# Altium project gprs.PrjPcb
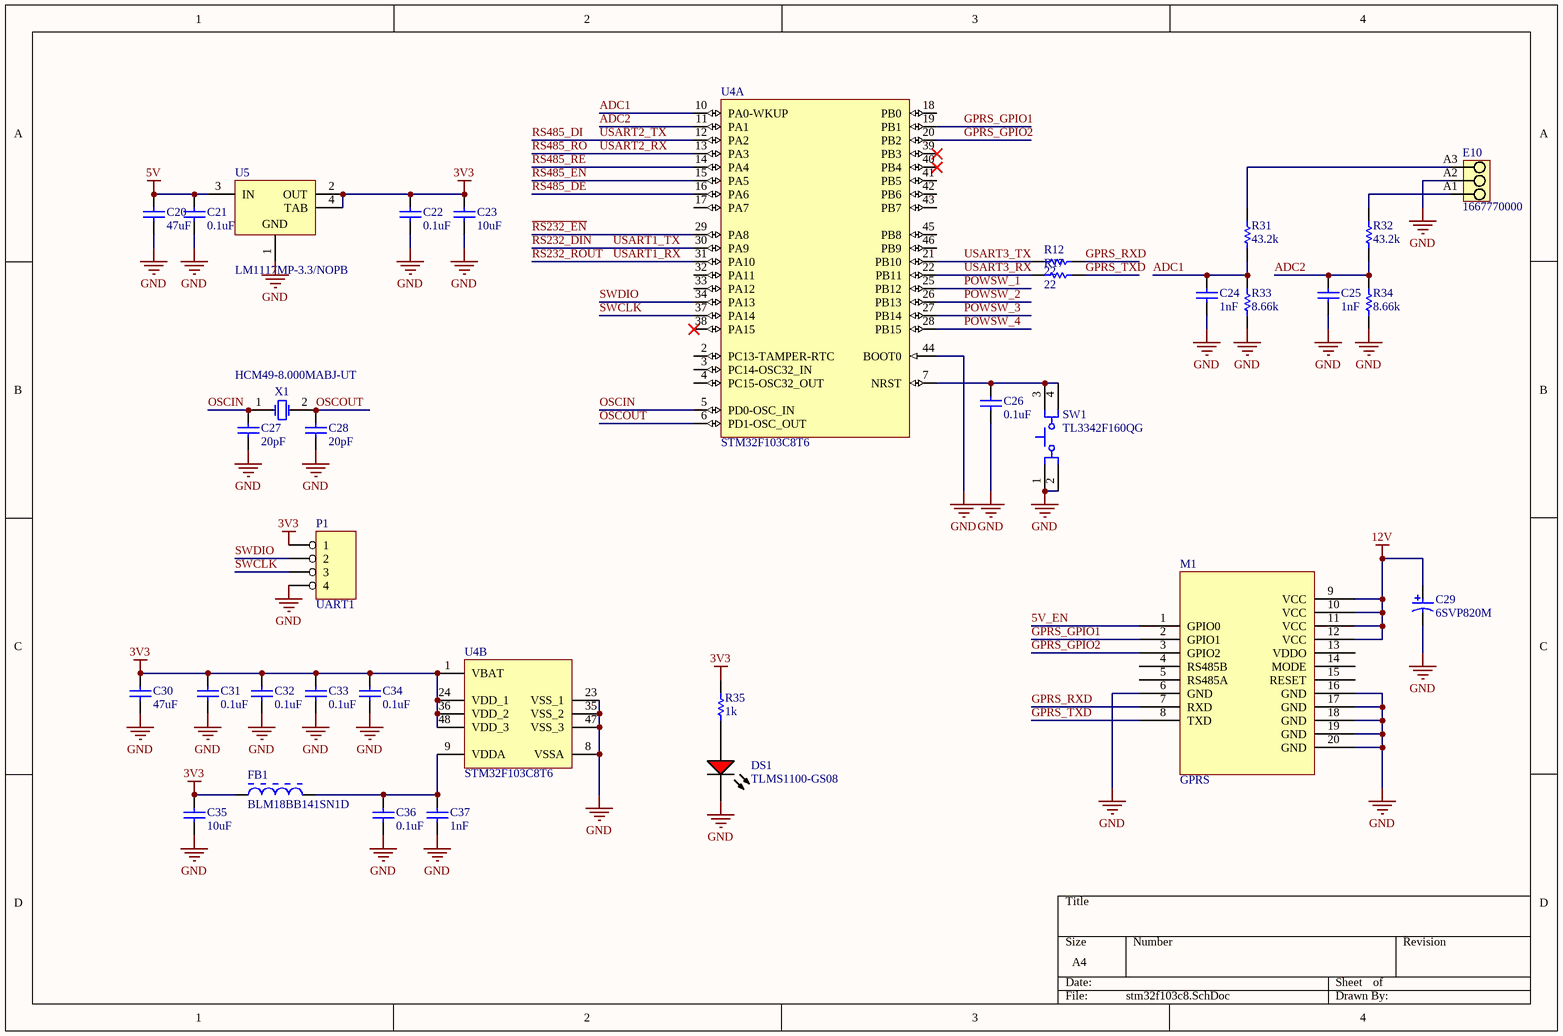
[diagram p0: stm32f103c8.SchDoc]
3 sheets, 114 parts. Net scope: global (net labels, ports and power ports of the same name join across sheets).
Board file: gprs1.PcbDoc
Sheets:
  stm32f103c8.SchDoc
  485&232.SchDoc
  power.SchDoc

## Sheet stm32f103c8.SchDoc
size A4

### Parts
C20  47uF  [CAPC1206(3216)150_L]
C21  0.1uF  [CAPC0603(1608)100_L]
C22  0.1uF  [CAPC0603(1608)100_L]
C23  10uF  [CAPC0805(2012)145_L]
C24  1nF  [CAPC0603(1608)100_L]
C25  1nF  [CAPC0603(1608)100_L]
C26  0.1uF  [CAPC0603(1608)100_L]
C27  20pF  [CAPC0603(1608)100_L]
C28  20pF  [CAPC0603(1608)100_L]
C29  6SVP820M  [PNSC-SVP-F12_L]
C30  47uF  [CAPC1206(3216)150_L]
C31  0.1uF  [CAPC0603(1608)100_L]
C32  0.1uF  [CAPC0603(1608)100_L]
C33  0.1uF  [CAPC0603(1608)100_L]
C34  0.1uF  [CAPC0603(1608)100_L]
C35  10uF  [CAPC0603(1608)100_L]
C36  0.1uF  [CAPC0603(1608)100_L]
C37  1nF  [CAPC0603(1608)100_L]
DS1  TLMS1100-GS08  [VISH-TLMX1100_V]
E10  1667770000  [LM_3_5_90_03]
FB1  BLM18BB141SN1D  [MURA-BLM18-RF-H4-CHIP-2_V]
M1  GPRS  [GPRS]
P1  UART1  [header4]
R12  22  [RESC0603(1608)_L]
R17  22  [RESC0603(1608)_L]
R31  43.2k  [RESC0603(1608)_L]
R32  43.2k  [RESC0603(1608)_L]
R33  8.66k  [RESC0603(1608)_L]
R34  8.66k  [RESC0603(1608)_L]
R35  1k  [RESC0603(1608)_L]
SW1  TL3342F160QG  [ESWI-TL3342F160QG_V]
U4  STM32F103C8T6  [STM-LQFP48_L]  (parts A,B of 2)
U5  LM1117MP-3.3/NOPB  [DCY0004A_L]
X1  HCM49-8.000MABJ-UT  [CFM-HCM49-2_V]

### Nets
3V3: C22.2 C23.2 C30.2 C31.2 C32.2 C33.2 C34.2 C35.2 FB1.1 P1.1 R35.2 U4.1(VBAT) U4.24(VDD_1) U4.36(VDD_2) U4.48(VDD_3) U5.2(OUT) U5.4(TAB)
5V: C20.2 C21.2 U5.3(IN)
12V: C29.1 M1.9(VCC) M1.10(VCC) M1.11(VCC) M1.12(VCC)
GND: C20.1 C21.1 C22.1 C23.1 C24.1 C25.1 C26.1 C27.1 C28.1 C29.2 C30.1 C31.1 C32.1 C33.1 C34.1 C35.1 C36.1 C37.1 DS1.2(K) E10.A2 M1.6(GND) M1.16(GND) M1.17(GND) M1.18(GND) M1.19(GND) M1.20(GND) P1.4 R33.1 R34.1 SW1.1 SW1.2 U4.8(VSSA) U4.23(VSS_1) U4.35(VSS_2) U4.44(BOOT0) U4.47(VSS_3) U5.1(GND)
5V_EN: M1.1(GPIO0)
ADC1: C24.2 R31.1 R33.2 U4.10(PA0-WKUP)
ADC2: C25.2 R32.1 R34.2 U4.11(PA1)
GPRS_GPIO1: M1.2(GPIO1) U4.19(PB1)
GPRS_GPIO2: M1.3(GPIO2) U4.20(PB2)
GPRS_RXD: M1.7(RXD) R12.1
GPRS_TXD: M1.8(TXD) R17.1
OSCIN: C27.2 U4.5(PD0-OSC_IN) X1.1(X1)
OSCOUT: C28.2 U4.6(PD1-OSC_OUT) X1.2(X2)
POWSW_1: U4.25(PB12)
POWSW_2: U4.26(PB13)
POWSW_3: U4.27(PB14)
POWSW_4: U4.28(PB15)
~{RS232_EN}: U4.29(PA8)
~{RS485_EN}: U4.15(PA5)
RS232_DIN: U4.30(PA9)  [also labelled USART1_TX]
RS232_ROUT: U4.31(PA10)  [also labelled USART1_RX]
RS485_DE: U4.16(PA6)
RS485_DI: U4.12(PA2)  [also labelled USART2_TX]
RS485_~{RE}: U4.14(PA4)
RS485_RO: U4.13(PA3)  [also labelled USART2_RX]
SWCLK: P1.3 U4.37(PA14)
SWDIO: P1.2 U4.34(PA13)
USART3_RX: R17.2 U4.22(PB11)
USART3_TX: R12.2 U4.21(PB10)
NetC26_2: C26.2 SW1.3 SW1.4 U4.7(NRST)
NetC36_2: C36.2 C37.2 FB1.2 U4.9(VDDA)
NetDS1_1: DS1.1(A) R35.1
NetE10_A1: E10.A1 R32.2
NetE10_A3: E10.A3 R31.2

Not connected (* = marked no-connect by the designer): M1 4(RS485B) 5(RS485A) 13(VDDO) 14(MODE) 15(RESET); U4 2(PC13-TAMPER-RTC) 3(PC14-OSC32_IN) 4(PC15-OSC32_OUT) 17(PA7) 18(PB0) 32(PA11) 33(PA12) 38(PA15)* 39(PB3)* 40(PB4)* 41(PB5) 42(PB6) 43(PB7) 45(PB8) 46(PB9)

### Library data of the parts
C20 C30 = CAP_5_3: 1206 (3216 Metric) Chip Capacitor; Case-Metric: 3216; Case-EIA: 1206; PackageReference: CAPC1206(3216)150
C21 C22 C24-C28 C31-C37 = CAP_5: 0603 (1608 Metric) Chip Capacitor; Case-Metric: 1608; Case-EIA: 0603; PackageReference: CAPC0603(1608)100
C23 = CAP_5_1: 0805 (2012 Metric) Chip Capacitor; Case-EIA: 0805; Case-Metric: 2012; PackageReference: CAPC0805(2012)145
C29 = CMP-2000-05494-1: Conductive Polymer Aluminum Solid Capacitor, 820 uF, +/- 20%, 6.3 V, -55 to 105 degC, 2-Pin SMD (F12), RoHS, Tape and Reel; Manufacturer: Panasonic; Featured Product: OS-CONCapacitorsHotNewTechnologies; Surface Mount Land Size: 0.406"Lx0.406"W(10.30mmx10.30mm); Online Catalog: OS-CON,SVPSeries; Other Names: P16463TR; ESR (Equivalent Series Resistance): 16mOhm; Lifetime @ Temp.: 2000Hrs@105°C; Polarization: Polar; Voltage Rating: 16V; Ripple Current: 4.72A; EDA / CAD Models: DownloadfromAcceleratedDesigns; Capacitance: 330µF; Operating Temperature: -55°C~105°C; Family: Aluminum-PolymerCapacitors; Packaging: Tape&Reel(TR); Series: OS-CON,SVP; Package Reference: SVP-F12; Package / Case: Radial,Can-SMD; Size / Dimension: 0.394"Dia(10.00mm); Mounting Type: SurfaceMount; Package Description: 2-Pin Surface Mount Device, Body 10.3 x 10.3 mm; Category: Capacitors; Datasheet URL: https://industrial.panasonic.com/cdbs/www-data/pdf/AAB8000/AAB8000C193.pdf; Tolerance: ±20%; Manufacturer URL: http://www.panasonic.com/; Height - Seated (Max): 0.500"(12.70mm); Mounting Technology: SurfaceMount; Datasheet Version: 11/2015; Standard Package: 400
DS1 = CMP-1666-00027-1: LED, RED, 2.1 V, -40 to 100 degC, 2-Pin SMD (0603), RoHS, Tape and Reel; Type (Capacitors): C0G; Resistance: 100000000000 Ohm; Capacitance: 12 pF; Voltage Rating: 50 V; Tolerance: 5%; Min Operating Temperature: -55degC; REACH SVHC: No SVHC; ComponentLink2Description: Datasheet; ComponentLink1URL: http://www.vishay.com/; Width: 0.8 mm; Package Quantity: 4000; PackageReference: TLMX1100; ComponentLink2URL: http://www.vishay.com/docs/83173/tlmb1100.pdf; Case/Package: 0603; Case Code (Metric): 1608; Packaging: Tape and Reel; Pins: 2; ComponentLink1Description: Manufacturer URL; Max Operating Temperature: 125degC; Height: 0.8 mm; Length: 1.6 mm; Mount: Surface Mount; PackageDescription: 2-Pin Surface Mount Device, Body 1.6 x 0.8 mm; DatasheetVersion: Rev. 2.7, 03/2016; Case Code (Imperial): 0603; Voltage Rating (DC): 50 V; RoHSCompliant: True; Radiation Hardening: No
E10 = CMP-1559-01729-1: OMNIMATE Signal - series LM; Manufacturer: Weidmueller; Contact_material: Cu-Leg; Contact_surface: tinned; Rated_current_use_group_B_UL_1059: 10 A; Insulating_material: PA; Wire_cross_section_AWG_min_UL_1059: AWG 28; Short_text_for_material: LM 3.50/03/90 3.2SN OR BX; Solid_max_H05_07_V_U: 1,5 mm²; Rated_current_min_no_of_poles_TU_20_deg_C: 32 A; Solder_pin_length_mm: 3,2 mm; Mounting_onto_the_PCB: Solder connection; Wire_cross_section_AWG_max_UL_1059: AWG 14; No_of_poles: 3; Rated_voltage_use_group_B_UL_1059: 300 V; Side_termination_characteristic: closed side; Rated_voltage_for_surge_voltage_class_pollution_degree_II_2: 320 V; UL_94_flammability_rating: V-2; Pitch_mm: 3,5 mm; Pitch_inch: 0,138 inch; Solid_min_H05_07_V_U: 0,5 mm²; ComponentLink2URL: http://catalog.weidmueller.com/catalog/Start.do?localeId=en&ObjectID=1667770000; Revision: V1; ComponentLink2Description: URL Link1; Packaging: Box; Colour: Orange; ComponentLink1Description: Manufacturer URL; PackageReference: LM_3_5_90_03; Qty: 100 PCS; PartNumber: 1667770000; ComponentLink1URL: http://www.weidmueller.com/
FB1 = MURA-FB-2: Chip Ferrite Bead for High-speed Signal Lines, 140 Ohm, 450 mA, -55 to 125 degC, 1.6 x 0.8 x 0.95 mm SMD, Tape and Reel; Manufacturer: Murata; Rated Current: 450 mA; DC Resistance: 0.35 Ohm Max.; Impedance (at 100 MHz): 140 Ohm +/- 25%; ComponentLink2URL: http://www.murata.com/products/catalog/pdf/c31e.pdf; ComponentLink1Description: Manufacturer URL; ComponentLink1URL: http://www.murata.com/; Packing: Tape and Reel; ComponentLink3URL: http://www.murata.com/products/catalog/pdf/c31e.pdf; PartNumber: BLM18BB141SN1D; Operating Temperature Range: -55 to 125 degC; PackageReference: BLM18_H950-2; DatasheetVersion: 08/2013; ComponentLink3Description: Package Specification; ComponentLink2Description: Datasheet; PackageDescription: 2-Pin Chip, Body 1.6 x 0.8 mm; Mounting Technology: Surface Mount
M1 = GPRS_M
P1 = HEADER 4
R12 R17 R31-R35 = RES_3_1: 0603 (1608 Metric) Chip Resistor; Case-Metric: 1608; Case-EIA: 0603; PackageReference: RESC0603(1608)
SW1 = CMP-1696-00003-1: Switch, Tactile, SPST-NO, 50 mA, 12 V, 4-Pin SMD, RoHS, Tape and Reel; Voltage Rating (DC): 50 V; Tolerance: 20%; Case\Package: Radial; Capacitance: 4.7 uF; Max Operating Temperature: 85 degC; REACH SVHC: No SVHC; Package Quantity: 200; Voltage Rating: 50 V; ComponentLink1Description: Manufacturer URL; ComponentLink2URL: http://spec_sheets.e-switch.com/specs/P010632.pdf; ComponentLink2Description: Datasheet; Height: 11 mm; Lead Pitch: 2 mm; RoHSCompliant: true; Radiation Hardening: No; Pins: 2; Length: 11 mm; DatasheetVersion: Rev. I, 12/2010; PackageReference: TL3342F160QG; ComponentLink1URL: http://www.e-switch.ch/en/; PackageDescription: 4-Pin Surface Mount Device, Body 5 x 5 mm, Pitch 6.3 mm; Mount: Through Hole; Diameter: 5 mm; Packaging: Bulk; Min Operating Temperature: -40 degC; Width: 0 inch
U4 = CMP-0237-00215-3: ARM Cortex-M3 32-bit MCU, 64 KB Flash, 20 KB Internal RAM, 37 I/Os, 48-pin LQFP, -40 to 85 degC, Tray; Supply Voltage(Vcc) min (V): 2; Internal RAM Size (kB): 20; FLASH Size (Prog) (kB): 64; A/D Converter: 2x12-bit (10 Channel); I/Os (High Current): 37; Operating Frequency(F) (Processor speed) (MHz): 72; Core: ARM Cortex-M3; ComponentLink3Description: Package Specification; Mounting Technology: Surface Mount; PartNumber: STM32F103C8T6; PackageReference: LQFP48; Packing: Tray; ComponentLink3URL: http://www.st.com/st-web-ui/static/active/en/resource/technical/document/datasheet/DM00058181.pdf; DatasheetVersion: Rev. 16; ComponentLink1URL: http://www.st.com/web/en/home.html; PackageVersion: Rev. 6, 06/2013; ComponentLink2URL: http://www.st.com/st-web-ui/static/active/en/resource/technical/document/datasheet/CD00161566.pdf; ComponentLink1Description: Manufacturer URL; ComponentLink2Description: Datasheet; PackageDescription: 48-Pin Low Profile Quad Flat Package, 7 x 7 mm Body, 0.5 mm Pitch
U5 = CMP-0062-01638-4: 800mA Low-Dropout Linear Regulator, 4-pin SOT-223, Pb-Free; Manufacturer: Texas Instruments; CompType: LDO IC; PackageTopMarking: XYTT*N05A; High-Reliability: Y; PowerWise: N; ComponentLink1URL: http://www.ti.com/general/docs/lit/getliterature.tsp?genericPartNumber=LM1117-N&fileType=pdf; PinCount: 4; PackageDescription: Molded SOT-223, 6.50 x 3.56 x 1.6mm Body, 4 Lead, 2.3mm Pitch; Code_IPC: SOT223-4; PartNumber: LM1117MP-3.3/NOPB; Code_JEDEC: TO-261-AA; RoHS: Y; PackageReference: DCY0004A; ComponentLink1Description: Datasheet URL
X1 = CMP-1215-00001-1: At-Cut Crystal Unit, 3.5 to 30 MHz, -40 to 85 degC, 2-Pin 11.4Ã—4.7Ã—4.3 mm SMD, RoHS, Reel; Manufacturer: Citizen Finetech Miyota; DL: 100 uW; C0: 7 pF Max.; R1: 50 to 200 Ohm; IR: 500 MOhm Min.; f0: 3.5 to 30 MHz; Mounting Technology: Surface Mount; Packing: Reel; ComponentLink2URL: http://cfm.citizen.co.jp/english/product/pdf/HCM49.pdf; PartNumber: HCM49-8.000MABJ-UT; Operating Temperature: -40 to 85 degC; ComponentLink3URL: http://cfm.citizen.co.jp/english/product/pdf/HCM49.pdf; ComponentLink2Description: Datasheet; ComponentLink3Description: Package Specification; ComponentLink1Description: Manufacturer URL; PackageDescription: 2-Pin Surface Mount, Body 11.4 x 4.7 mm, Pitch 8.5 mm; DatasheetVersion: Jan-12; RoHS: TRUE; ComponentLink1URL: http://cfm.citizen.co.jp/english/index.html

## Sheet 485&232.SchDoc
size A4
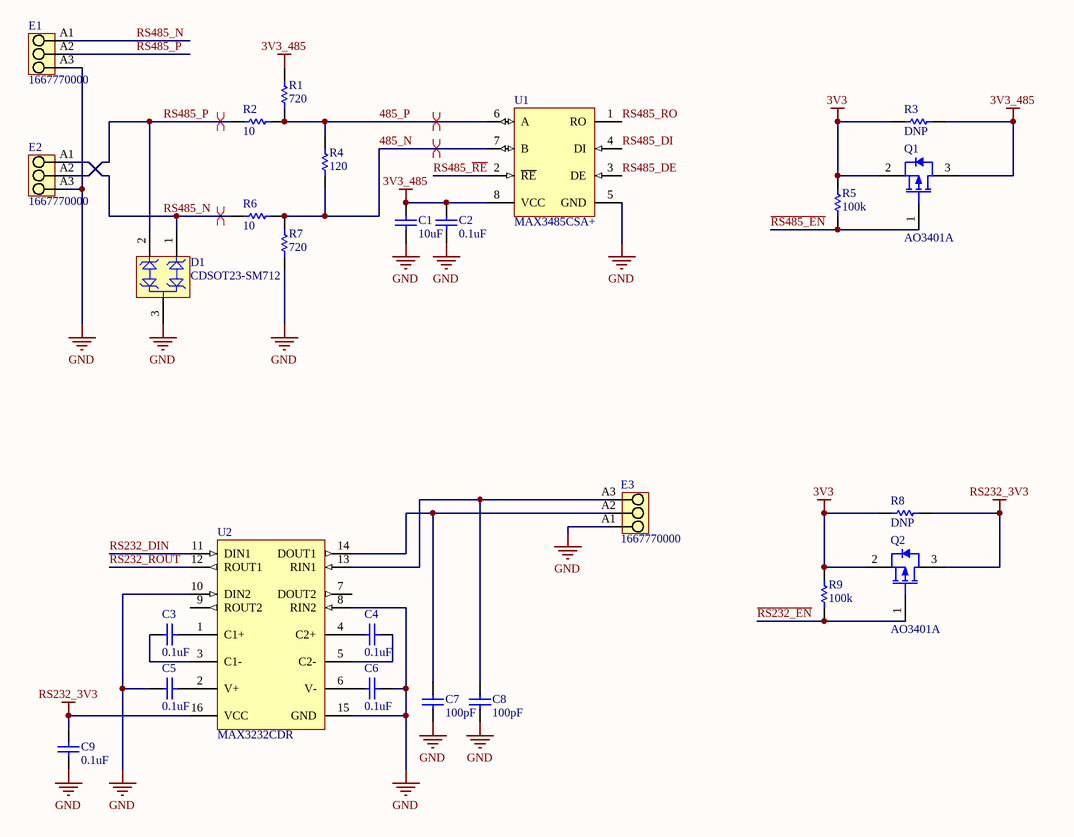
[diagram p1: 485&232.SchDoc]

### Parts
C1  10uF  [CAPC0805(2012)145_L]
C2  0.1uF  [CAPC0603(1608)100_L]
C3  0.1uF  [CAPC0603(1608)100_L]
C4  0.1uF  [CAPC0603(1608)100_L]
C5  0.1uF  [CAPC0603(1608)100_L]
C6  0.1uF  [CAPC0603(1608)100_L]
C7  100pF  [CAPC0603(1608)100_L]
C8  100pF  [CAPC0603(1608)100_L]
C9  0.1uF  [CAPC0603(1608)100_L]
D1  CDSOT23-SM712  [BOUR-SOT23-3_V]
E1  1667770000  [LM_3_5_90_03]
E2  1667770000  [LM_3_5_90_03]
E3  1667770000  [LM_3_5_90_03]
Q1  AO3401A  [AO-SOT-23-3L_V]
Q2  AO3401A  [AO-SOT-23-3L_V]
R1  720  [RESC0603(1608)_L]
R2  10  [RESC0603(1608)_L]
R3  DNP  [RESC0603(1608)_L]
R4  120  [RESC0603(1608)_L]
R5  100k  [RESC0603(1608)_L]
R6  10  [RESC0603(1608)_L]
R7  720  [RESC0603(1608)_L]
R8  DNP  [RESC0603(1608)_L]
R9  100k  [RESC0603(1608)_L]
U1  MAX3485CSA+  [SOIC-8]
U2  MAX3232CDR  [D0016A_L]

### Nets
3V3: Q1.2(SOURCE) Q2.2(SOURCE) R3.1 R5.1 R8.1 R9.1
3V3_485: C1.2 C2.2 Q1.3(DRAIN) R1.1 R3.2 U1.8(VCC)
GND: C1.1 C2.1 C5.2 C6.2 C7.1 C8.1 C9.1 D1.3 E1.A3 E2.A3 E3.A1 R7.2 U1.5(GND) U2.8(RIN2) U2.10(DIN2) U2.15(GND)
RS232_3V3: C9.2 Q2.3(DRAIN) R8.2 U2.16(VCC)
485_N: R4.2 R6.2 R7.1 U1.7(B)
485_P: R1.2 R2.2 R4.1 U1.6(A)
~{RS232_EN}: Q2.1(GATE) R9.2
~{RS485_EN}: Q1.1(GATE) R5.2
RS232_DIN: U2.11(DIN1)
RS232_ROUT: U2.12(ROUT1)
RS485_DE: U1.3(DE)
RS485_DI: U1.4(DI)
RS485_N: D1.1 E1.A1 E2.A1 R6.1
RS485_P: D1.2 E1.A2 E2.A2 R2.1
RS485_~{RE}: U1.2(~{RE})
RS485_RO: U1.1(RO)
NetC3_1: C3.1 U2.1(C1+)
NetC3_2: C3.2 U2.3(C1-)
NetC4_1: C4.1 U2.5(C2-)
NetC4_2: C4.2 U2.4(C2+)
NetC5_1: C5.1 U2.2(V+)
NetC6_1: C6.1 U2.6(V-)
NetC7_2: C7.2 E3.A2 U2.14(DOUT1)
NetC8_2: C8.2 E3.A3 U2.13(RIN1)

Not connected (* = marked no-connect by the designer): U2 7(DOUT2) 9(ROUT2)

### Layout directives
differential pair: 485_N, 485_P, RS485_N, RS485_P

### Library data of the parts
C1 = CAP_5_1: as C23 on sheet stm32f103c8; PackageReference: CAPC0805(2012)145
C2-C6 C9 = CAP_5: as C21 on sheet stm32f103c8; PackageReference: CAPC0603(1608)100
C7 C8 = CMP-1590-00005-1: 0603 (1608 Metric) Chip Capacitor; Case-Metric: 1608; Case-EIA: 0603; PackageReference: CAPC0603(1608)100
D1 = CMP-2000-05081-1: Surface Mount TVS Diode, 17 A Ipp, -55 to 150 degC, 3-Pin SOT23, RoHS, Tape and Reel; Manufacturer: Bourns; Catalog Drawings: CDSOT23-SM712Schematic; Current - Peak Pulse (10/1000µs): 17A(8/20µs); Voltage - Breakdown (Min): 7.5V,13.3V; Online Catalog: CDSOT23Series; Power Line Protection: No; Bidirectional Channels: 2; Type: Zener; For Use With: EVAL-CN0313-SDPZ-ND-EVALEMCRS-485CERTIFIED; Kits: PN-DESIGNKIT-22-ND-KITESD/EFTSURGEPROTECTION; Capacitance @ Frequency: 75pF@1MHz; Product Training Modules: ESDProtectionProducts; Voltage - Clamping (Max) @ Ipp: 14V,26V; Voltage - Reverse Standoff (Typ): 7V(Max),12V(Max); Related Products: ADM3485EARZ-REEL7TR-ND-ICTXRXRS-485HS3.3V8SOICADM3485EARZ-REEL7CT-ND-ICTXRXRS-485HS3.3V8SOICADM3485EARZ-REEL7DKR-ND-ICTXRXRS-485HS3.3V8SOICADM3485EARZ-ND-ICTX/RXRS-485HS3.3V8-SOICADM3485EAR-ND-ICTX/RXRS-485HS3.3V8-SOIC296-38503-5-ND-ICTXRXRS4853.3VESD14SOIC296-38501-5-ND-ICRS485TXRX3.3ESD8SOIC296-38522-5-ND-ICTXRXRS4853.3V14SOIC296-38502-5-ND-ICTXRXRS4853.3VESD14SOICADM3485EARZ-REELTR-ND-ICTXRXRS-4853.3V8SOICADM3485EARZ-REELCT-ND-ICTXRXRS-4853.3V8SOICADM3485EARZ-REELDKR-ND-ICTXRXRS-4853.3V8SOIC296-40517-2-ND-ICTXRXRS4853.3V14SOIC296-40517-1-ND-ICTXRXRS4853.3V14SOIC296-40517-6-ND-ICTXRXRS4853.3V14SOIC296-40519-2-ND-ICRS485TXRX3.3ESD8SOIC296-40519-1-ND-ICRS485TXRX3.3ESD8SOIC296-40519-6-ND-ICRS485TXRX3.3ESD8SOIC296-40524-2-ND-ICTXRXRS4853.3VESD8SOIC296-40524-1-ND-ICTXRXRS4853.3VESD8SOIC296-40524-6-ND-ICTXRXRS4853.3VESD8SOIC296-40522-2-ND-ICTXRXRS4853.3VESD14SOIC296-40522-1-ND-ICTXRXRS4853.3VESD14SOIC296-40522-6-ND-ICTXRXRS4853.3VESD14SOIC296-40529-2-ND-ICRS485TXRX3.3ESD8SOIC296-40529-1-ND-ICRS485TXRX3.3ESD8SOIC2; Other Names: CDSOT23-SM712CT; Power - Peak Pulse: 400W; Applications: GeneralPurpose; Supplier Device Package: SOT-23-3; Package / Case: TO-236-3,SC-59,SOT-23-3; Mounting Type: SurfaceMount; Datasheet URL: https://datasheet.ciiva.com/11193/cdsot23-sm712-11193846.pdf; Standard Package: 1; Series: -; Category: CircuitProtection; Unidirectional Channels: -; Package Description: 3-Lead Small Out-Line Transistor, Body 2.9x1.3mm, Pitch 0.95mm; Family: TVS-Diodes; Datasheet Version: Aug-12; Manufacturer URL: http://www.bourns.com/; Operating Temperature: -55degC~150degC(TJ); Packaging: CutTape(CT)
E1-E3 = CMP-1559-01729-1: as E10 on sheet stm32f103c8; ComponentLink2URL: http://catalog.weidmueller.com/catalog/Start.do?localeId=en&ObjectID=1667770000; Revision: V1; ComponentLink2Description: URL Link1; Packaging: Box; Colour: Orange; ComponentLink1Description: Manufacturer URL; PackageReference: LM_3_5_90_03; Qty: 100 PCS; PartNumber: 1667770000; ComponentLink1URL: http://www.weidmueller.com/
Q1 Q2 = CMP-2000-05778-1: P-Channel MOSFET, 30 V, 4 A, -55 to 150 degC, 3-Pin SOT-23-3L, RoHS, Tape and Reel; Manufacturer: Alpha and Omega; Output Power (Max): NotRequiredW; Power Dissipation: 1.4W; Rad Hardened: No; Drain Efficiency: NotRequired%; Drain-Source On-Volt: 30V; Noise Figure: NotRequireddB; Frequency (Max): NotRequiredMHz; Number of  Elements: 1; Gate-Source Voltage (Max): ?12V; Drain Current (Max): 4A; Channel Mode: Enhancement; Drain-Source On-Res: 0.044ohm; Type: PowerMOSFET; Polarity: P; Package URL: http://www.aosmd.com/res/packaging_information/SOT-23-3L.pdf; Datasheet URL: http://www.aosmd.com/res/data_sheets/AO3401A.pdf; Package Type: SOT-23; Package Description: 3-Pin Small Outline Transistor, Body 2.95 x 1.6 mm, Pitch 0.95 mm; Mounting: SurfaceMount; Manufacturer URL: http://www.aosmd.com/; Continuous Drain Current: 4A; Package Reference: SOT-23-3L; Mounting Technology: SurfaceMount; Operating Temperature Classification: Military; Power Gain: NotRequireddB; Datasheet Version: Rev. 3, 03/2011; Operating Temp Range: -55Cto150C; Pin Count: 3
R1-R9 = RES_3_1: as R12 on sheet stm32f103c8; PackageReference: RESC0603(1608)
U1 = MAXM-MAX485CSA+-8: Low-Power, Slew-Rate-Limited RS-485/RS-422 Transceiver, 3.3 V, 0 to 70 degC, 8-Pin SOIC, RoHS, Tape and Reel; Manufacturer: Maxim; No. of Receivers: 1; Transceiver Type: Differential; Supply Voltage Min: 4.75V; IC Generic Number: 485; IC Temperature Range: Commercial; No. of Pins: 8; Supply Voltage Range: 4.75Vto5.25V; Interface: RS-422/RS-485; Supply Voltage Max: 5.25V; Data Rate: 2.5Mbps; Line / Bus Driver / Receiver / Transceiver Type: CMOSDifferential; Supply Current: 500µA; Interface Type: RS422,RS485; Device Type: Transceiver; Manufacturer URL: http://www.maximintegrated.com/; Operating Temperature Range: 0degCto+70degC; Package / Case: SOIC; Digital IC Case Style: SOIC; Operating Temperature Max: 70degC; Device Marking: MAX485CSA+; Driver Case Style: SOIC; Datasheet Version: Rev. 8, 10/2003; Operating Temperature Min: 0degC; Datasheet URL: https://datasheet.ciiva.com/29306/170071-da-01-en-ic-max485csa-so8-29306144.pdf; Base Number: 485; No. of Drivers: 1; Logic Function Number: 485
U2 = TI-MAX3232-SOIC_D-16: 3-V to 5.5-V Multichannel RS-232 Line Driver / Receiver with ±15-kV ESD Protection, 0 to 70 degC, 16-Pin SOIC (D), Green (RoHS & no Sb/Br); Receivers Per Package: 2; ESD HBM(kV): +/-15; ICC(Max)(mA): 1; Supply Voltage(s)(V): 3.3 or 5.0; Single Supply: TRUE; ComponentLink1URL: www.ti.com; ComponentLink3URL: http://www.ti.com/litv/pdf/mpds178g; PackageReference: D0016A; ComponentLink2Description: Datasheet; ComponentLink2URL: http://www.ti.com/general/docs/lit/getliterature.tsp?genericPartNumber=MAX3232&fileType=pdf; ComponentLink1Description: Manufacturer URL; PackageDescription: 16-Pin Plastic Small Outline Integrated Circuit, 9.9 x 3.9 mm, Pitch 1.27 mm Pitch; PackageVersion: revM, Jun-2011; Drivers Per Package: 2; SubFamily: RS-232; DatasheetVersion: SLLS410I; ComponentLink3Description: Package Specification; RS-232: TRUE

## Sheet power.SchDoc
size A4
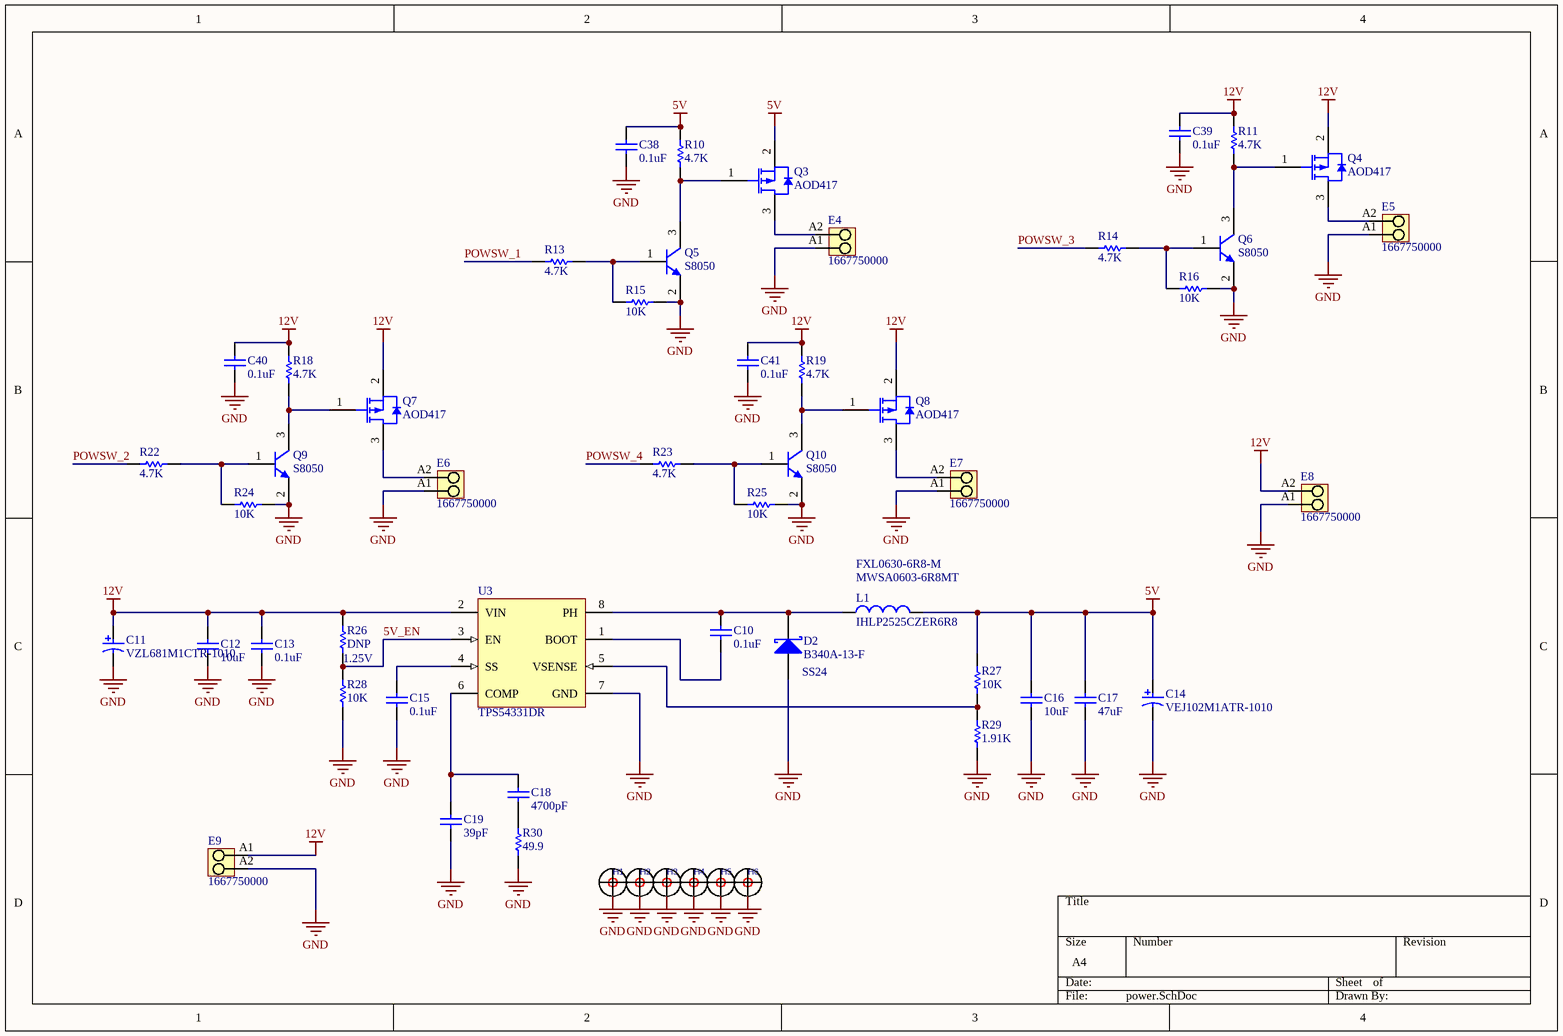
[diagram p2: power.SchDoc]

### Parts
C10  0.1uF  [CAPC0603(1608)100_L]
C11  VZL681M1CTR-1010  [PNSC-SVP-F12_L]
C12  10uF  [CAPC0805(2012)145_L]
C13  0.1uF  [CAPC0603(1608)100_L]
C14  VEJ102M1ATR-1010  [PNSC-SVP-F12_L]
C15  0.1uF  [CAPC0603(1608)100_L]
C16  10uF  [CAPC0805(2012)145_L]
C17  47uF  [CAPC1206(3216)150_L]
C18  4700pF  [CAPC0603(1608)100_L]
C19  39pF  [CAPC0603(1608)100_L]
C38  0.1uF  [CAPC0603(1608)100_L]
C39  0.1uF  [CAPC0603(1608)100_L]
C40  0.1uF  [CAPC0603(1608)100_L]
C41  0.1uF  [CAPC0603(1608)100_L]
D2  B340A-13-F  [DIOD-SMA-2_V]
E4  1667750000  [LM_3_5_90_02]
E5  1667750000  [LM_3_5_90_02]
E6  1667750000  [LM_3_5_90_02]
E7  1667750000  [LM_3_5_90_02]
E8  1667750000  [LM_3_5_90_02]
E9  1667750000  [LM_3_5_90_02]
H1  HOLE  [HOLE_Φ3_3]  (value not drawn)
H2  HOLE  [HOLE_Φ3_3]  (value not drawn)
H3  HOLE  [HOLE_Φ3_3]  (value not drawn)
H4  HOLE  [HOLE_Φ3_3]  (value not drawn)
H5  HOLE  [HOLE_Φ3_3]  (value not drawn)
H6  HOLE  [HOLE_Φ3_3]  (value not drawn)
L1  IHLP2525CZER6R8  [VISH-IHLP2525CZER220M11_V]
Q3  AOD417  [DIOD-TO252-3_V]
Q4  AOD417  [DIOD-TO252-3_V]
Q5  S8050  [KOCN-SOT23-3_L]
Q6  S8050  [KOCN-SOT23-3_L]
Q7  AOD417  [DIOD-TO252-3_V]
Q8  AOD417  [DIOD-TO252-3_V]
Q9  S8050  [KOCN-SOT23-3_L]
Q10  S8050  [KOCN-SOT23-3_L]
R10  4.7K  [RESC0603(1608)_L]
R11  4.7K  [RESC0603(1608)_L]
R13  4.7K  [RESC0603(1608)_L]
R14  4.7K  [RESC0603(1608)_L]
R15  10K  [RESC0603(1608)_L]
R16  10K  [RESC0603(1608)_L]
R18  4.7K  [RESC0603(1608)_L]
R19  4.7K  [RESC0603(1608)_L]
R22  4.7K  [RESC0603(1608)_L]
R23  4.7K  [RESC0603(1608)_L]
R24  10K  [RESC0603(1608)_L]
R25  10K  [RESC0603(1608)_L]
R26  DNP  [RESC0603(1608)_L]
R27  10K  [RESC0603(1608)_L]
R28  10K  [RESC0603(1608)_L]
R29  1.91K  [RESC0603(1608)_L]
R30  49.9  [RESC0603(1608)_L]
U3  TPS54331DR  [D8_N]

### Nets
5V: C14.1 C16.2 C17.2 C38.2 L1.2 Q3.2(SOURCE) R10.1 R27.1
12V: C11.1 C12.2 C13.2 C39.2 C40.2 C41.2 E8.A2 E9.A1 Q4.2(SOURCE) Q7.2(SOURCE) Q8.2(SOURCE) R11.1 R18.1 R19.1 R26.1 U3.2(VIN)
GND: C11.2 C12.1 C13.1 C14.2 C15.1 C16.1 C17.1 C19.1 C38.1 C39.1 C40.1 C41.1 D2.1(A) E4.A1 E5.A1 E6.A1 E7.A1 E8.A1 E9.A2 H1.1 H2.1 H3.1 H4.1 H5.1 H6.1 Q5.2(EMITTER) Q6.2(EMITTER) Q9.2(EMITTER) Q10.2(EMITTER) R15.2 R16.2 R24.2 R25.2 R28.2 R29.2 R30.2 U3.7(GND)
5V_EN: R26.2 R28.1 U3.3(EN)
POWSW_1: R13.1
POWSW_2: R22.1
POWSW_3: R14.1
POWSW_4: R23.1
NetC10_1: C10.1 U3.1(BOOT)
NetC10_2: C10.2 D2.2(K) L1.1 U3.8(PH)
NetC15_2: C15.2 U3.4(SS)
NetC18_1: C18.1 R30.1
NetC18_2: C18.2 C19.2 U3.6(COMP)
NetE4_A2: E4.A2 Q3.3(DRAIN)
NetE5_A2: E5.A2 Q4.3(DRAIN)
NetE6_A2: E6.A2 Q7.3(DRAIN)
NetE7_A2: E7.A2 Q8.3(DRAIN)
NetQ3_1: Q3.1(GATE) Q5.3(COLLECTOR) R10.2
NetQ4_1: Q4.1(GATE) Q6.3(COLLECTOR) R11.2
NetQ5_1: Q5.1(BASE) R13.2 R15.1
NetQ6_1: Q6.1(BASE) R14.2 R16.1
NetQ7_1: Q7.1(GATE) Q9.3(COLLECTOR) R18.2
NetQ8_1: Q8.1(GATE) Q10.3(COLLECTOR) R19.2
NetQ9_1: Q9.1(BASE) R22.2 R24.1
NetQ10_1: Q10.1(BASE) R23.2 R25.1
NetR27_2: R27.2 R29.1 U3.5(VSENSE)

### Notes on the sheet
- (near L1) FXL0630-6R8-M
- (near L1) MWSA0603-6R8MT
- (near R26) 1.25V
- (near D2) SS24

### Library data of the parts
C10 C13 C15 C18 C19 C38-C41 = CMP-1590-00005-1: as C7 on sheet 485&232; PackageReference: CAPC0603(1608)100
C11 = CMP-2000-05494-1: 680uF,16V,-55~105℃; Manufacturer: Lelon; Surface Mount Land Size: 0.406"Lx0.406"W(10.30mmx10.30mm); Online Catalog: OS-CON,SVPSeries; Other Names: P16463TR; Tolerance: ±20%; Lifetime @ Temp.: 2000Hrs@105°C; Polarization: Polar; Ripple Current: 4.72A; Capacitance: 680µF; Operating Temperature: -55°C~105°C; Family: Aluminum Capacitors; Packaging: Tape&Reel(TR); Series: OS-CON,SVP; Package / Case: Radial,Can-SMD; Size / Dimension: 0.394"Dia(10.00mm); Mounting Type: SurfaceMount; Package Description: 2-Pin Surface Mount Device, Body 10.3 x 10.3 mm; Category: Capacitors; Datasheet URL: https://atta.szlcsc.com/upload/public/pdf/source/20171023/C134843_15087477624341052967.pdf; Voltage Rating: 16V; Mounting Technology: SurfaceMount; Standard Package: 400
C12 C16 = CAP_5_1: as C23 on sheet stm32f103c8; PackageReference: CAPC0805(2012)145
C14 = CMP-2000-05494-1: 1000uF,10V,-55~105℃; Manufacturer: Lelon; Surface Mount Land Size: 0.406"Lx0.406"W(10.30mmx10.30mm); Online Catalog: OS-CON,SVPSeries; Other Names: P16463TR; Tolerance: ±20%; Lifetime @ Temp.: 2000Hrs@105°C; Polarization: Polar; Ripple Current: 4.72A; Capacitance: 1000µF; Operating Temperature: -55°C~105°C; Family: Aluminum Capacitors; Packaging: Tape&Reel(TR); Series: OS-CON,SVP; Package / Case: Radial,Can-SMD; Size / Dimension: 0.394"Dia(10.00mm); Mounting Type: SurfaceMount; Package Description: 2-Pin Surface Mount Device, Body 10.3 x 10.3 mm; Category: Capacitors; Datasheet URL: https://atta.szlcsc.com/upload/public/pdf/source/20171023/C134843_15087477624341052967.pdf; Voltage Rating: 10V; Mounting Technology: SurfaceMount; Standard Package: 400
C17 = CAP_5_3: as C20 on sheet stm32f103c8; PackageReference: CAPC1206(3216)150
D2 = CMP-1667-00003-1: Surface Mount Schottky Barrier Rectifier, 40 V, 3 A, -55 to 150 degC, 2-Pin SMA, RoHS, Tape and Reel; Forward Current: 3 A; Forward Voltage: 500 mV; Max Surge Current: 80 A; Peak Reverse Current: 500 uA; Elements: 1; Mounting Technology: Surface Mount; ComponentLink1URL: http://www.diodes.com/; PackageDescription: 2-Pin Surface Mounted Assembly, Body 4.3 x 2.605 mm, Height 2.4 mm; Min Operating Temperature: -55 degC; Mount: Surface Mount; Pins: 2; ComponentLink2URL: http://www.diodes.com/_files/datasheets/ds30891.pdf; PackageReference: SMA-2; Max Operating Temperature: 125 degC; Radiation Hardening: No; Length: 4.6 mm; RoHSCompliant: true; ComponentLink1Description: Manufacturer URL; Height: 2.1 mm; ComponentLink2Description: Datasheet; Packaging: Tape and Reel; Package Quantity: 5000; Case\Package: SMA; DatasheetVersion: Rev. 17 - 2, 09/2015; REACH SVHC: No SVHC; Width: 2.92 mm
E4-E9 = CMP-1559-01728-1: OMNIMATE Signal - series LM; Manufacturer: Weidmueller; Rated_voltage_for_surge_voltage_class_pollution_degree_II_2: 320 V; Rated_current_use_group_B_UL_1059: 10 A; Short_text_for_material: LM 3.50/02/90 3.2SN OR BX; UL_94_flammability_rating: V-2; Solid_min_H05_07_V_U: 0,5 mm²; Pitch_mm: 3,5 mm; Solid_max_H05_07_V_U: 1,5 mm²; Rated_voltage_use_group_B_UL_1059: 300 V; Wire_cross_section_AWG_min_UL_1059: AWG 28; Contact_material: Cu-Leg; Rated_current_min_no_of_poles_TU_20_deg_C: 32 A; Contact_surface: tinned; Mounting_onto_the_PCB: Solder connection; Wire_cross_section_AWG_max_UL_1059: AWG 14; No_of_poles: 2; Pitch_inch: 0,138 inch; Solder_pin_length_mm: 3,2 mm; Side_termination_characteristic: closed side; Insulating_material: PA; Revision: V1; ComponentLink1Description: Manufacturer URL; PartNumber: 1667750000; ComponentLink2URL: http://catalog.weidmueller.com/catalog/Start.do?localeId=en&ObjectID=1667750000; PackageReference: LM_3_5_90_02; Qty: 100 PCS; Colour: Orange; ComponentLink2Description: URL Link1; Packaging: Box; ComponentLink1URL: http://www.weidmueller.com/
H1-H6 = HOLE: CLASS: IC; CAD_APPROVED: Yes; MFG_PN01: TP-105-01-09; MFG_NAME01: COMPONENTS CORPORATION; AGILE_PN: 210-75685; HEIGHT: 4.8 MM; ROHS: Yes
L1 = CMP-2000-06442-1: Low Profile, High Current IHLP(R) Inductor, 6.8 uH, +/- 20%, 2.9 A, -55 to 125 degC, 2-Pin SMD, RoHS, Tape and Reel; Manufacturer: Vishay; Inductance: 22µH; Frequency - Test: 100kHz; Product Training Modules: IHLPInductorSeries; DC Resistance (DCR): 135mOhmMax; Shielding: Shielded; Current Rating: 2.9A; Current - Saturation: 2.5A; Series: IHLP-2525CZ-11; Package Description: 2-Pin Surface Mount Device, Body 6.86 x 6.47 mm; Package Reference: IHLP2525CZER220M11; Size / Dimension: 0.270"Lx0.255"Wx0.118"H(6.86mmx6.47mmx3.00mm); Category: Inductors,Coils,Chokes; Mounting Technology: SurfaceMount; Operating Temperature: -55°C~125°C; Tolerance: ±20%; Manufacturer URL: http://www.vishay.com/; Family: FixedInductors; Standard Package: 2,000; Packaging: Tape&Reel(TR); Mounting Type: SurfaceMount; Package / Case: NonStandard; Datasheet Version: 09/2013; Datasheet URL: https://datasheet.ciiva.com/11798/0900766b8102c935-11798417.pdf
Q3 Q4 Q7 Q8 = CMP-1667-00002-2: P-Channel Enhancement Mode MOSFET, -30V, -25 A, -55 to 150 degC, 3-Pin DPAK (TO252), RoHS, Tape and Reel; Manufacturer: Diodes Inc; DatasheetVersion: Rev. 2-2, 08/2014; Packaging: Tape and Reel; Min Operating Temperature: -55 degC; Package Quantity: 2500; Pins: 3; RoHSCompliant: true; ComponentLink1Description: Manufacturer URL; Mounting Technology: Surface Mount; Mount: Surface Mount; PackageDescription: 3-Pin Transistor Outline, Body 6.1 x 6.575 mm, Pitch 2.286 mm; ComponentLink1URL: http://www.diodes.com/; PackageReference: TO252-3; Length: 6.73 mm; Max Operating Temperature: 150 degC; ComponentLink2Description: Datasheet; Height: 2.39 mm; ComponentLink2URL: http://www.diodes.com/_files/datasheets/ZXMP10A18K.pdf; REACH SVHC: No SVHC
Q5 Q6 Q9 Q10 = CMP-0564-00001-1: NPN Transistor, 0.8 A Collector Current, 3-Pin SOT23, RoHS, Tape and Reel; Manufacturer: Koo Chin; V (BR) CEO (min): 25 V; VCE (sat) (max): 0.6 V; VBE (sat) (max): 1.2 V; IEBO (max): 0.1 uA; V (BR) EBO (min): 5 V; V (BR) CBO (min): 40 V; fT(min): 150 MHz; Packing: Tape and Reel; ComponentLink2URL: http://www.hz-dz.net/UploadFiles/2009812164318190.pdf; ComponentLink3URL: http://galaxycn.com/jsp/upload/S8050.pdf; RoHS: TRUE; ComponentLink2Description: Datasheet; PartNumber: S8050; ComponentLink3Description: Package Specification; DatasheetVersion: 17/08/2009; ComponentLink1URL: http://www.hz-dz.net/; PackageReference: SOT23-3; ICBO (max): 0.1 uA; ICEO (max): 0.1 uA; Mounting Technology: Surface Mount; PackageDescription: 3-Pin Small Out-Line Transistor, Body 1.3 x 2.9 mm, Pitch 0.95 mm; ComponentLink1Description: Manufacturer URL; NPN/PNP: NPN
R10 R11 R13-R16 R18 R19 R22-R30 = RES_3_1: as R12 on sheet stm32f103c8; PackageReference: RESC0603(1608)
U3 = CMP-0323-00209-2: Buck Step Down Regulator with 3.5 to 28 V Input and 0.8 to 25 V Output, -40 to 150 degC, 8-Pin SOIC (D), Green (RoHS & no Sb/Br); Manufacturer: Texas Instruments; Vout(Max)(V): 25; SubFamily: Step-Down Regulator; Switch Current Limit(Typ)(A): 3.5; Duty Cycle(Max)(%): 90; Vout(Min)(V): 0.8; Iout(Max)(A): 3; Rating: Catalog; Iq(Typ)(mA): 0.11; Vin(Max)(V): 28; Regulated Outputs(#): 1; PackageDescription: 8-Pin Plastic Small Outline Integrated Circuit, 4.9 x 3.9 mm, Pitch 1.27 mm Pitch; PartNumber: TPS54331DR; DatasheetVersion: SLVS839D; Eco-Plan: Green (RoHS & no Sb/Br); PackageVersion: revM, Jun-2011; ComponentLink3URL: Samples URL:http://www.ti.com/product/tps54331#samples; ComponentLink2Description: Package Specification; ComponentLink3Description: URL Link1; Code_JEDEC: MS-012AA; Mounting Technology: Surface Mount; Topology: Buck; Vin(Min)(V): 3.5; ComponentLink1Description: Datasheet; ComponentLink1URL: http://www.ti.com/general/docs/lit/getliterature.tsp?genericPartNumber=TPS54331&fileType=pdf; ComponentLink2URL: http://www.ti.com/litv/pdf/msoi002j; PackageReference: D8

## Nets that join several sheets
3V3: stm32f103c8 (17 pins), 485&232 (6 pins)
5V: stm32f103c8 (C20.2 C21.2 U5.3), power (8 pins)
12V: stm32f103c8 (5 pins), power (16 pins)
GND: stm32f103c8 (37 pins), 485&232 (16 pins), power (37 pins)
5V_EN: stm32f103c8 (M1.1), power (R26.2 R28.1 U3.3)
POWSW_1: stm32f103c8 (U4.25), power (R13.1)
POWSW_2: stm32f103c8 (U4.26), power (R22.1)
POWSW_3: stm32f103c8 (U4.27), power (R14.1)
POWSW_4: stm32f103c8 (U4.28), power (R23.1)
~{RS232_EN}: stm32f103c8 (U4.29), 485&232 (Q2.1 R9.2)
~{RS485_EN}: stm32f103c8 (U4.15), 485&232 (Q1.1 R5.2)
RS232_DIN: stm32f103c8 (U4.30), 485&232 (U2.11)
RS232_ROUT: stm32f103c8 (U4.31), 485&232 (U2.12)
RS485_DE: stm32f103c8 (U4.16), 485&232 (U1.3)
RS485_DI: stm32f103c8 (U4.12), 485&232 (U1.4)
RS485_~{RE}: stm32f103c8 (U4.14), 485&232 (U1.2)
RS485_RO: stm32f103c8 (U4.13), 485&232 (U1.1)